# EAGLE design faros-328P-nrf8001-50x50 (EAGLE 7.2.0)
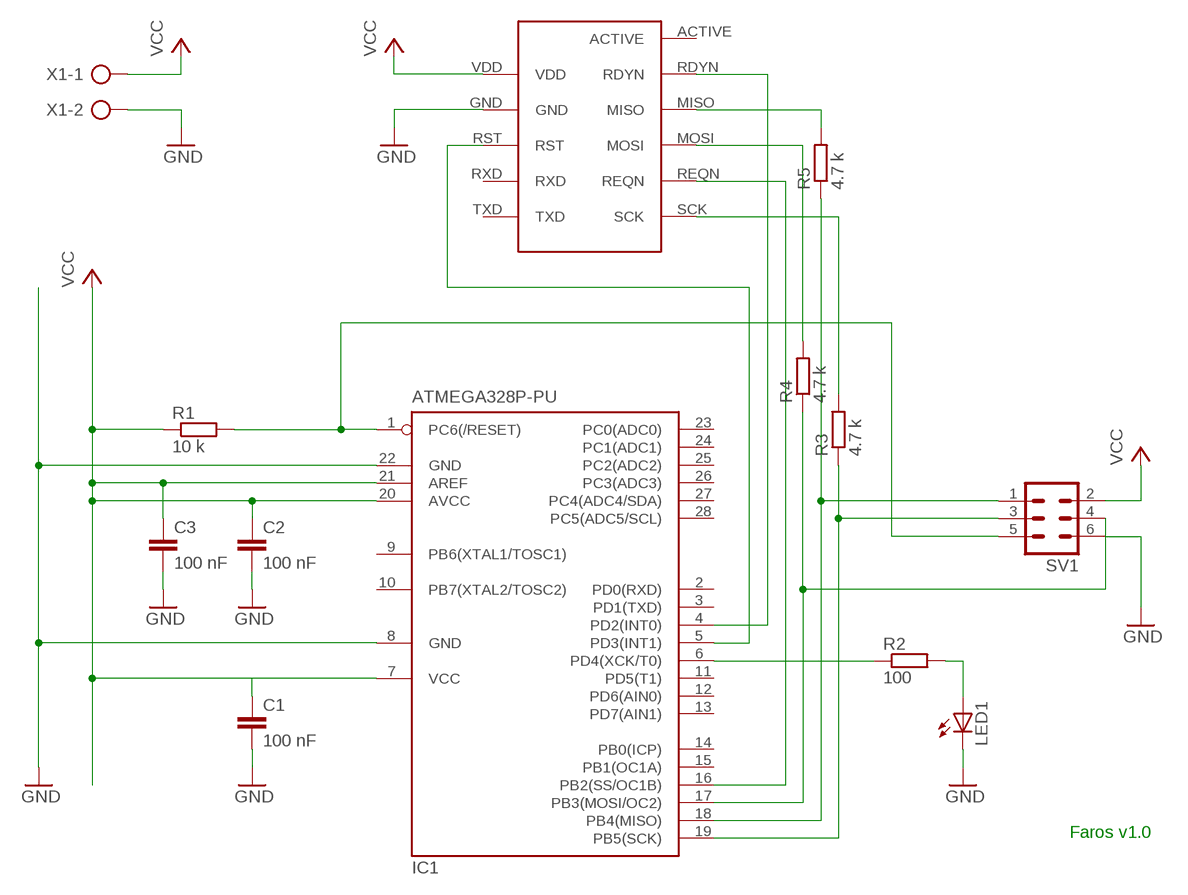
[diagram p0: schematic, sheet 1]

## Parts
C1  100 nF  C-EU050-024X044  [C050-024X044]
C2  100 nF  C-EU050-024X044  [C050-024X044]
C3  100 nF  C-EU050-024X044  [C050-024X044]
IC1  ATMEGA328P-PU  MEGA8-P  [DIL28-3]
LED1  LED3MM  [LED3MM]
MOD1  MOD-NRF8001MOD-NRF8001  [MOD-NRF8001]
R1  10 k  R-EU_0207/7  [0207/7]
R2  100  R-EU_0207/7  [0207/7]
R3  4.7 k  R-EU_0207/7  [0207/7]
R4  4.7 k  R-EU_0207/7  [0207/7]
R5  4.7 k  R-EU_0207/7  [0207/7]
SV1  MA03-2  [MA03-2]
X1  AK500/2  [AK500/2]

## Nets
GND: C1.2 C2.2 C3.2 IC1.8(GND) IC1.22(GND) LED1.K(C) MOD1.GND SV1.6 X1.2
N$1: IC1.4(PD2(INT0)) MOD1.RDYN
N$2: IC1.19(PB5(SCK)) R3.1 SV1.3
N$3: IC1.1(PC6(/RESET)) R1.2 SV1.5
N$4: MOD1.MOSI R4.2
N$5: MOD1.MISO R5.2
N$6: IC1.5(PD3(INT1)) MOD1.RST
N$7: LED1.A R2.2
N$8: IC1.6(PD4(XCK/T0)) R2.1
N$10: MOD1.SCK R3.2
N$12: IC1.16(PB2(SS/OC1B)) MOD1.REQN
N$14: IC1.18(PB4(MISO)) R5.1 SV1.1
N$16: C1.1 C2.1 C3.1 IC1.7(VCC) IC1.20(AVCC) IC1.21(AREF) MOD1.VDD R1.1 SV1.2 X1.1 ; supply symbol labelled VCC
N$19: IC1.17(PB3(MOSI/OC2)) R4.1 SV1.4
Unconnected: IC1.2(PD0(RXD)) IC1.3(PD1(TXD)) IC1.9(PB6(XTAL1/TOSC1)) IC1.10(PB7(XTAL2/TOSC2)) IC1.11(PD5(T1)) IC1.12(PD6(AIN0)) IC1.13(PD7(AIN1)) IC1.14(PB0(ICP)) IC1.15(PB1(OC1A)) IC1.23(PC0(ADC0)) IC1.24(PC1(ADC1)) IC1.25(PC2(ADC2)) IC1.26(PC3(ADC3)) IC1.27(PC4(ADC4/SDA)) IC1.28(PC5(ADC5/SCL)) MOD1.ACTIVE MOD1.RXD MOD1.TXD

## Notes on the sheet
- Faros v1.0

## Library data of the parts
C1-C3 = rcl:C-EU: CAPACITOR, European symbol
IC1 = atmel:MEGA8-P: MICROCONTROLLER 8 Kbytes FLASH, 1 kbytes SRAM, 512 bytes EEPROM, USART, 4-channel 10 bit ADC, 2-channel 8 bit ADC Pin compatible with Atmega48, ATMega88, ATMega168 Source: avr.lbr; OC_FARNELL: unknown; OC_NEWARK: unknown
LED1 = led:LED: LED OSRAM: - CHIPLED LG R971, LG N971, LY N971, LG Q971, LY Q971, LO R971, LY R971 LH N974, LH R974 LS Q976, LO Q976, LY Q976 LO Q996 - Hyper CHIPLED LW Q18S LB Q993, LB Q99A, LB R99A - SideLED LS A670, LO A670, LY A670, LG A670, LP A670 LB A673, LV A673, LT A673, LW A673 LH A674 LY A675 LS A676, LA A676, LO A676, LY A676, LW A676 LS A679, LY A679, LG A679 - Hyper Micro SIDELED® LS Y876, LA Y876, LO Y876, LY Y876 LT Y87S - SmartLED LW L88C, LW L88S LB L89C, LB L89S, LG L890 LS L89K, LO L89K, LY L89K LS L896, LA L896, LO L896, LY L896 - TOPLED LS T670, LO T670, LY T670, LG T670, LP T670 LSG T670, LSP T670, LSY T670, LOP T670, LYG T670 LG T671, LOG T671, LSG T671 LB T673, LV T673, LT T673, LW T673 LH T674 LS T676, LA T676, LO T676, LY T676, LB T676, LH T676, LSB T676, LW T676 LB T67C, LV T67C, LT T67C, LS T67K, LO T67K, LY T67K, LW E67C LS E67B, LA E67B, LO E67B, LY E67B, LB E67C, LV E67C, LT E67C LW T67C LS T679, LY T679, LG T679 LS T770, LO T770, LY T770, LG T770, LP T770 LB T773, LV T773, LT T773, LW T773 LH T774 LS E675, LA E675, LY E675, LS T675 LS T776, LA T776, LO T776, LY T776, LB T776 LHGB T686 LT T68C, LB T68C - Hyper Mini TOPLED® LB M676 - Mini TOPLED Santana® LG M470 LS M47K, LO M47K, LY M47K Source: http://www.osram.convergy.de LUXEON: - LUMILED® LXK2-PW12-R00, LXK2-PW12-S00, LXK2-PW14-U00, LXK2-PW14-V00 LXK2-PM12-R00, LXK2-PM12-S00, LXK2-PM14-U00 LXK2-PE12-Q00, LXK2-PE12-R00, LXK2-PE12-S00, LXK2-PE14-T00, LXK2-PE14-U00 LXK2-PB12-K00, LXK2-PB12-L00, LXK2-PB12-M00, LXK2-PB14-N00, LXK2-PB14-P00, LXK2-PB14-Q00 LXK2-PR12-L00, LXK2-PR12-M00, LXK2-PR14-Q00, LXK2-PR14-R00 LXK2-PD12-Q00, LXK2-PD12-R00, LXK2-PD12-S00 LXK2-PH12-R00, LXK2-PH12-S00 LXK2-PL12-P00, LXK2-PL12-Q00, LXK2-PL12-R00 Source: www.luxeon.com KINGBRIGHT: KA-3528ASYC Source: www.kingbright.com
MOD1 = frankduerr:MOD-NRF8001
R1-R5 = rcl:R-EU_: RESISTOR, European symbol
SV1 = con-lstb:MA03-2: PIN HEADER; OC_FARNELL: unknown; OC_NEWARK: unknown
X1 = con-ptr500:AK500/2: CONNECTOR; OC_FARNELL: unknown; OC_NEWARK: unknown

## Board
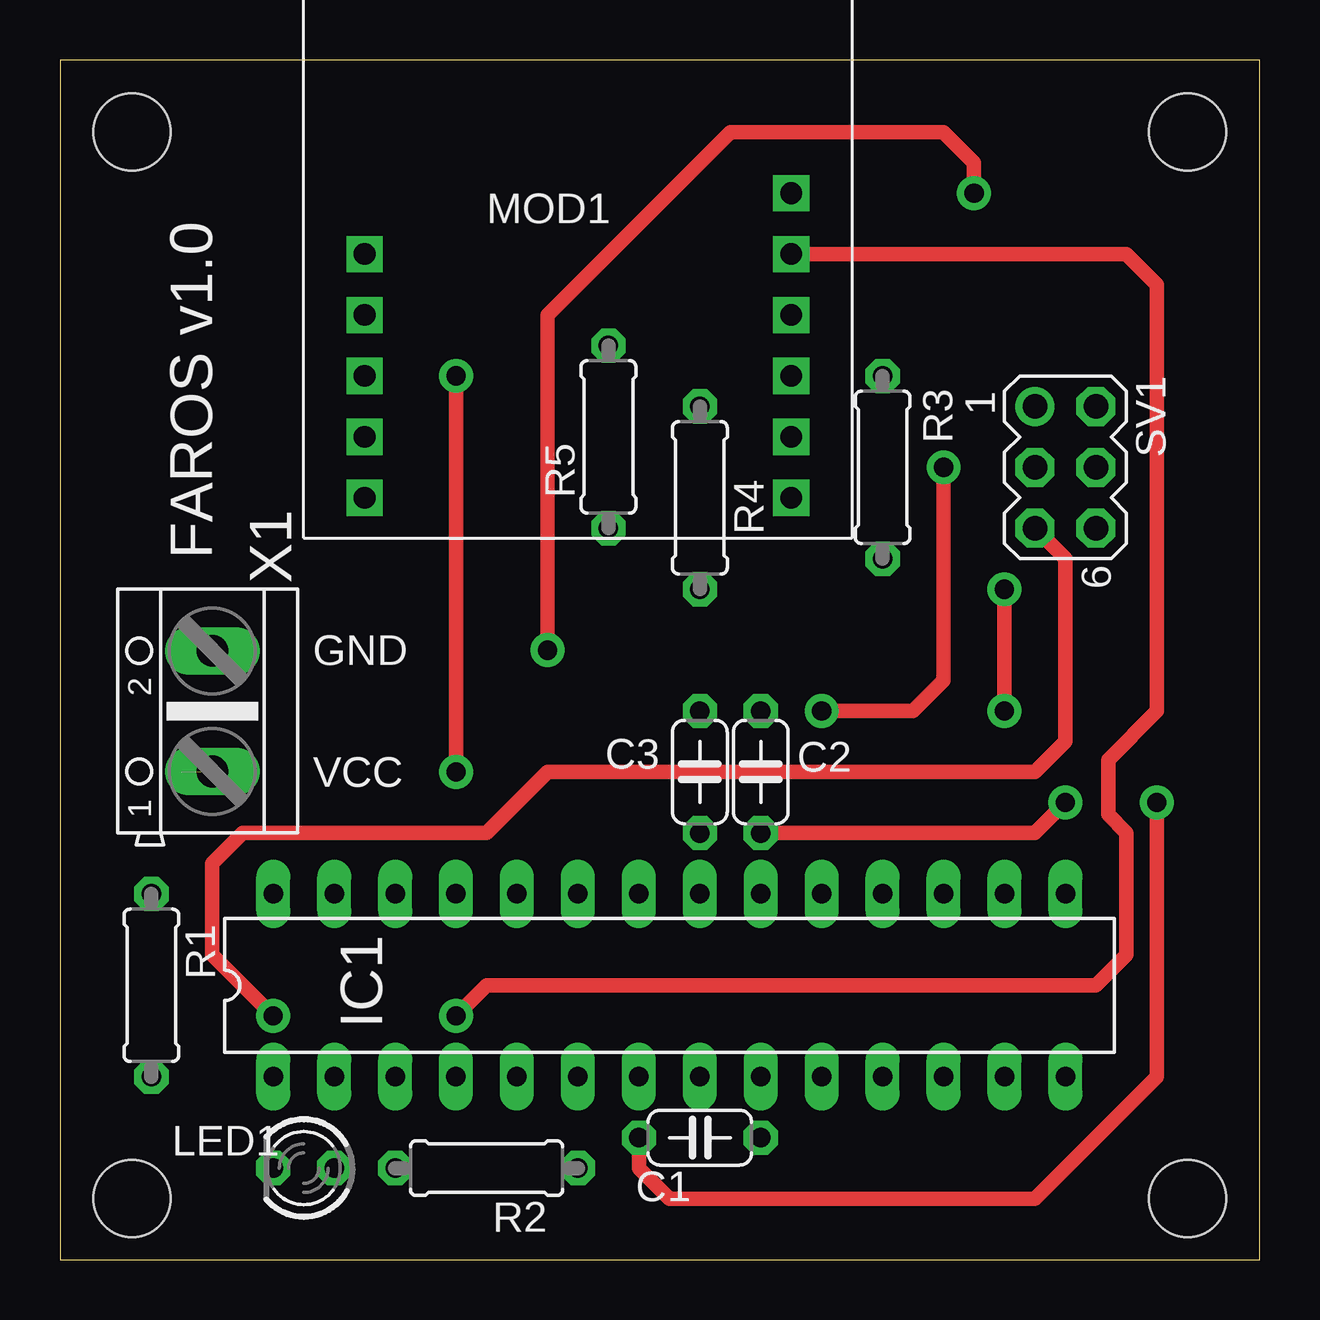
[diagram p1: board, top side]
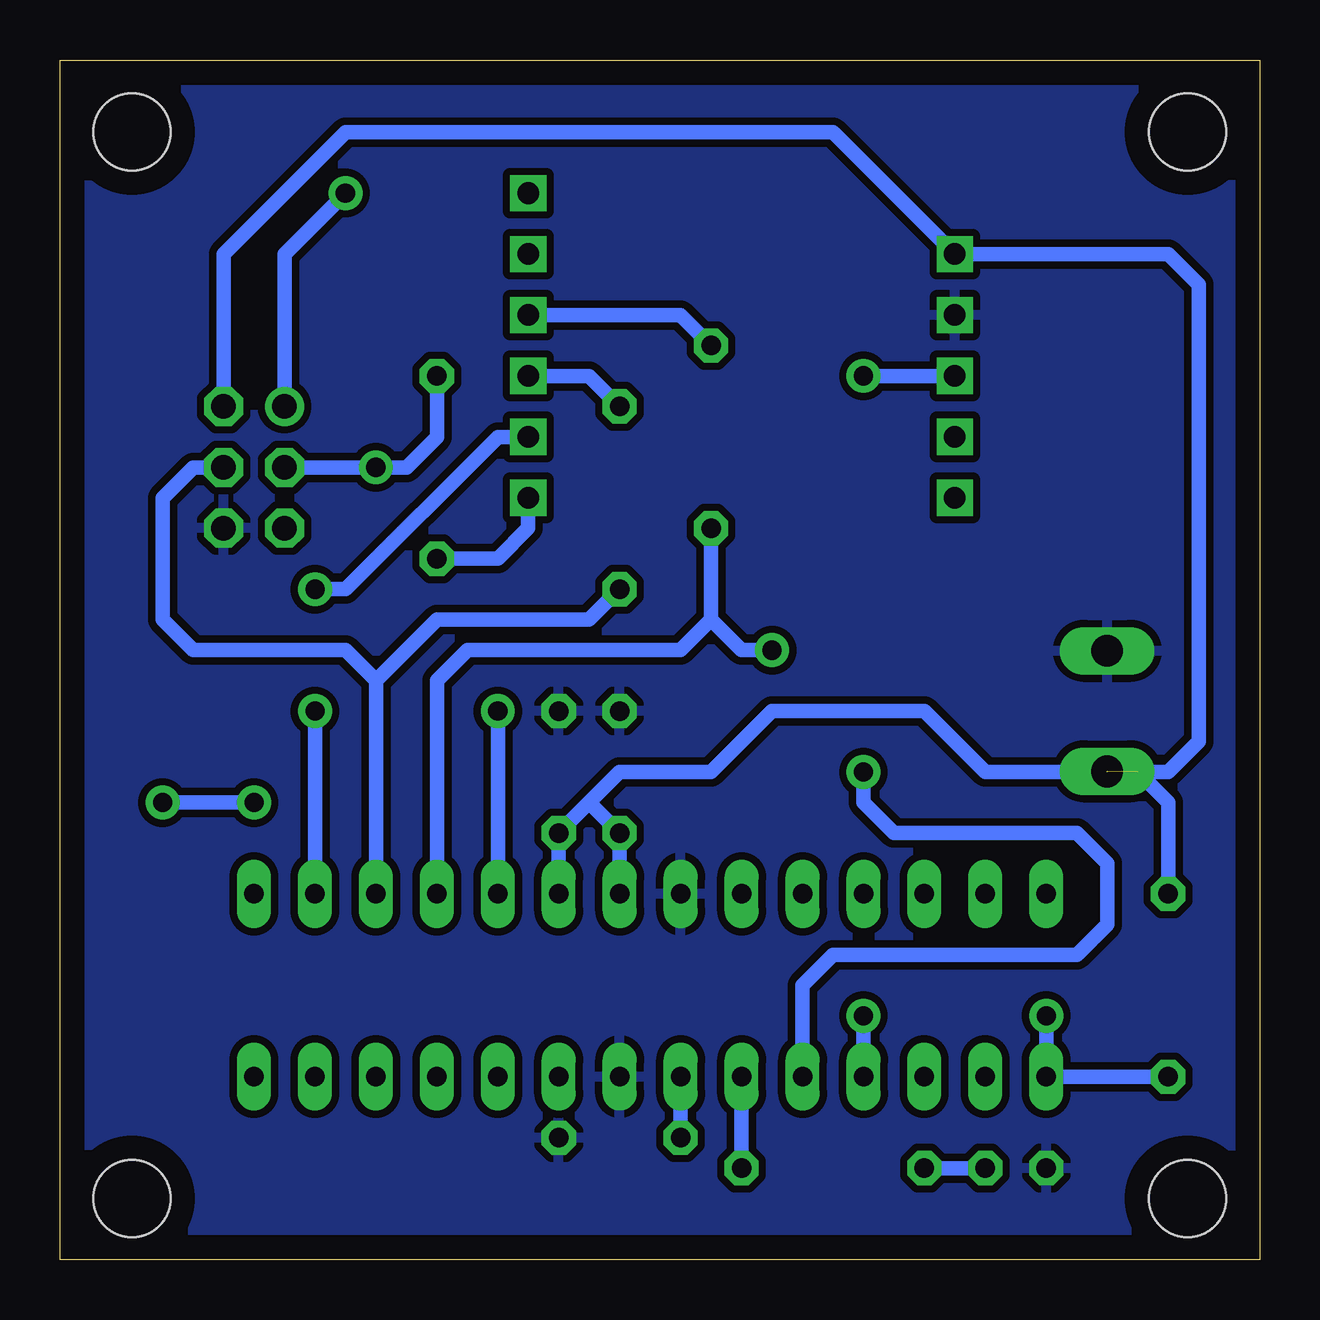
[diagram p2: board, bottom side, seen from below]

Size 50 x 50 mm. Coordinates in mm from the lower left corner, seen from the top.
Outline: 0,0 50,0 50,50 0,50 0,0
Copper layers (1*16): Top 0.035mm / dielectric 1.5mm / Bottom 0.035mm
Design rules "default *": minimum track width 12mil, minimum drill 24mil, track to track 12mil, track to pad 12mil, pad to pad 12mil, via to via 12mil, smd to smd 8mil, copper to edge 40mil, drill to drill 8mil, minimum pad ring 12mil, minimum via ring 12mil, stop-mask expansion 4mil, vias tented up to drill 0mil, thermal gap 12mil
Holes 3.2 mm at 3,2.54 47,2.54 47,47 3,47

### Footprints (pad centres in the part's own frame; a part is rotated, then mirrored left to right if it is on the bottom)
C050-024X044 = drill 0.813 octagon: 1 -2.54,0; 2 2.54,0
DIL28-3 = drill 0.813 long: 1 -16.51,-3.81; 2 -13.97,-3.81; 3 -11.43,-3.81; 4 -8.89,-3.81; 5 -6.35,-3.81; 6 -3.81,-3.81; 7 -1.27,-3.81; 8 1.27,-3.81; 9 3.81,-3.81; 10 6.35,-3.81; 11 8.89,-3.81; 12 11.43,-3.81; 13 13.97,-3.81; 14 16.51,-3.81; 15 16.51,3.81; 16 13.97,3.81; 17 11.43,3.81; 18 8.89,3.81; 19 6.35,3.81; 20 3.81,3.81; 21 1.27,3.81; 22 -1.27,3.81; 23 -3.81,3.81; 24 -6.35,3.81; 25 -8.89,3.81; 26 -11.43,3.81; 27 -13.97,3.81; 28 -16.51,3.81
LED3MM = drill 0.813 octagon: A -1.27,0; K 1.27,0
MOD-NRF8001 = drill 0.9 square: ACTIVE 8.89,-1.27; GND -8.89,-6.35; MISO 8.89,-6.35; MOSI 8.89,-8.89; RDYN 8.89,-3.81; REQN 8.89,-11.43; RST -8.89,-8.89; RXD -8.89,-11.43; SCK 8.89,-13.97; TXD -8.89,-13.97; VDD -8.89,-3.81
0207/7 = drill 0.813 octagon: 1 -3.81,0; 2 3.81,0
MA03-2 = drill 1.016: 1 -2.54,-1.27 | drill 1.016 octagon: 2 -2.54,1.27; 3 0,-1.27; 4 0,1.27; 5 2.54,-1.27; 6 2.54,1.27
AK500/2 = drill 1.321 long: 1 -2.515,0; 2 2.515,0

### Placement (x,y rotation side)
C1  26.67,5.08 0 top
C2  29.21,20.32 90 top
C3  26.67,20.32 90 top
IC1  25.4,11.43 0 top
LED1  10.16,3.81 180 top
MOD1  21.59,45.72 0 top
R1  3.81,11.43 270 top
R2  17.78,3.81 180 top
R3  34.29,33.02 270 top
R4  26.67,31.75 90 top
R5  22.86,34.29 90 top
SV1  41.91,33.02 270 top
X1  6.35,22.86 90 top

### Tracks (layer width: path | path; a pad name or v marks a point on that pad's centre or on a via)
GND
  pour Bottom: -2.54,50.8 52.07,50.8 52.07,-2.54 -2.54,-2.54
N$1  (via drill 0.8)
  Top 0.61: v16.51,10.16 17.78,11.43 43.18,11.43 44.45,12.7 44.45,17.78 43.69,18.54 43.69,20.83 45.72,22.86 45.72,40.64 44.45,41.91 MOD1.RDYN
  Bottom 0.61: IC1.4 v16.51,10.16
N$2  (via drill 0.8)
  Top 0.61: v31.75,22.86 35.56,22.86 36.83,24.13 v36.83,33.02
  Bottom 0.61: SV1.3 v36.83,33.02 35.56,33.02 34.29,34.29 R3.1 | IC1.19 v31.75,22.86
N$3  (via drill 0.8)
  Top 0.61: v8.89,10.16 6.35,12.7 6.35,16.51 7.62,17.78 17.78,17.78 20.32,20.32 40.64,20.32 41.91,21.59 41.91,29.21 SV1.5
  Bottom 0.61: R1.2 IC1.1 v8.89,10.16
N$4
  Bottom 0.61: R4.2 27.94,36.83 MOD1.MOSI
N$5
  Bottom 0.61: R5.2 24.13,39.37 MOD1.MISO
N$6  (via drill 0.8)
  Top 0.61: v16.51,20.32 v16.51,36.83
  Bottom 0.61: IC1.5 19.05,11.43 17.78,12.7 7.62,12.7 6.35,13.97 6.35,16.51 7.62,17.78 15.24,17.78 16.51,19.05 v16.51,20.32 | v16.51,36.83 MOD1.RST
N$7
  Bottom 0.61: LED1.A R2.2
N$8
  Bottom 0.61: IC1.6 R2.1
N$10
  Bottom 0.61: R3.2 31.75,29.21 30.48,30.48 MOD1.SCK
N$12  (via drill 0.8)
  Top 0.61: v39.37,22.86 v39.37,27.94
  Bottom 0.61: IC1.16 v39.37,22.86 | MOD1.REQN 31.75,34.29 38.1,27.94 v39.37,27.94
N$14  (via drill 0.8)
  Top 0.61: v38.1,44.45 38.1,45.72 36.83,46.99 27.94,46.99 20.32,39.37 v20.32,25.4
  Bottom 0.61: R5.1 22.86,26.67 | 22.86,26.67 24.13,25.4 33.02,25.4 34.29,24.13 IC1.18 | SV1.1 40.64,41.91 v38.1,44.45 | v20.32,25.4 21.59,25.4 22.86,26.67
N$16  (via drill 0.8)  (2 unrouted)
  Top 0.61: C2.1 40.64,17.78 v41.91,19.05 | v45.72,19.05 45.72,7.62 40.64,2.54 25.4,2.54 24.13,3.81 C1.1
  Bottom 0.61: 6.35,20.32 11.43,20.32 13.97,22.86 20.32,22.86 22.86,20.32 26.67,20.32 27.94,19.05 | IC1.7 C1.1 | 27.94,19.05 C3.1 IC1.21 | 27.94,19.05 C2.1 IC1.20 | R1.1 3.81,19.05 5.08,20.32 3.81,20.32 2.54,21.59 2.54,40.64 3.81,41.91 MOD1.VDD 17.78,46.99 38.1,46.99 43.18,41.91 SV1.2 | v41.91,19.05 v45.72,19.05
N$19
  Bottom 0.61: SV1.4 44.45,33.02 45.72,31.75 45.72,26.67 44.45,25.4 38.1,25.4 36.83,24.13 | R4.1 27.94,26.67 34.29,26.67 36.83,24.13 | 36.83,24.13 IC1.17

### Text on the board
tPlace: FAROS v1.0 | GND | VCC